# EAGLE design flight comp v3 (EAGLE 9.4.2)
CNAME: FLIGHT COMPUTER; CREVISION: V1; DESIGNER: MICHAEL KIMANI
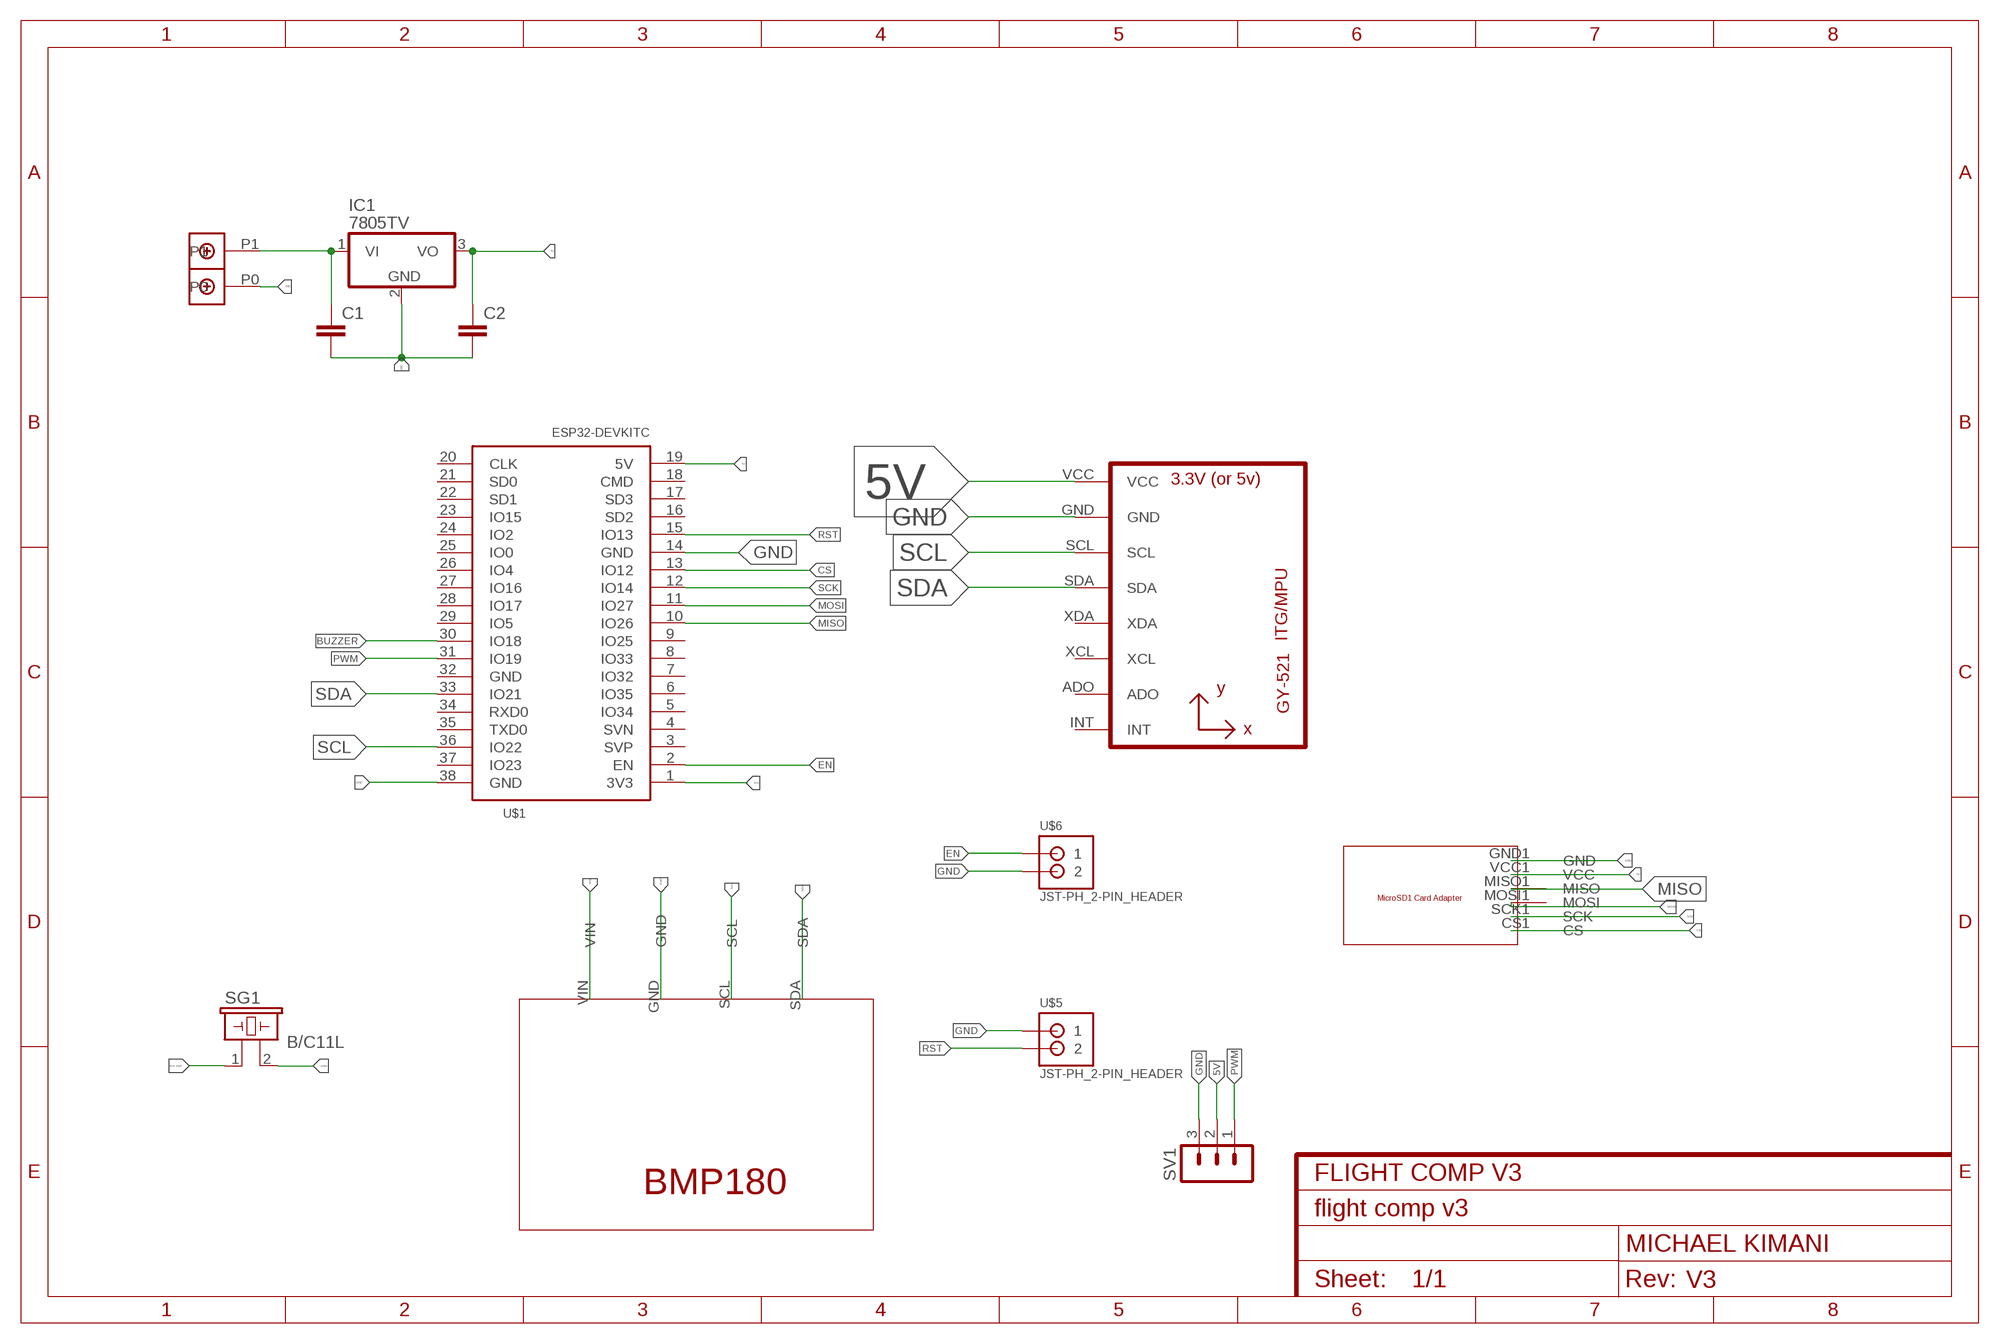
[diagram p0: schematic, sheet 1]
FRAME1 (FRAME-A4L): CNAME: FLIGHT COMP V3; CREVISION: V3; DESIGNER: MICHAEL KIMANI

## Parts
C1  C2,5-3  [C2.5-3]
C2  C2,5-3  [C2.5-3]
IC1  7805TV  [TO220V]
SG1  B/C11L  [B/C11L]
SV1  MA03-1  [MA03-1]
U1  GY-521MPU6050  [GY-521]
U$1  ESP32DEVKITC  [ESP32-DEVKITC]
U$2  MICROSDADAPTER  [MICROSDADAPTER]
U$3  BMP180  [BMP180]
U$4  DBCONN-1X2  [DBCONN-1X2]
U$5  JST-PH_2-PIN_HEADER  [JST_B2B-PH_HEADER]
U$6  JST-PH_2-PIN_HEADER  [JST_B2B-PH_HEADER]

## Nets
3V3: U$1.1(3V3) U$3.VIN
5V: C2.1 IC1.3(VO) SV1.2 U1.VCC U$1.19(5V) U$2.VCC1(VCC)
BUZZER: SG1.1 U$1.30(IO18)
CS: U$1.13(IO12) U$2.CS1(CS)
EN: U$1.2(EN) U$6.P1
GND: C1.2 C2.2 IC1.2(GND) SG1.2 SV1.3 U1.GND U$1.14(GND) U$1.38(GND) U$2.GND1(GND) U$3.GND U$4.P0 U$5.P1 U$6.P2
MISO: U$1.10(IO26) U$2.MISO1(MISO)
MOSI: U$1.11(IO27) U$2.MOSI1(MOSI)
N$1: C1.1 IC1.1(VI) U$4.P1
PWM: SV1.1 U$1.31(IO19)
RST: U$1.15(IO13) U$5.P2
SCK: U$1.12(IO14) U$2.SCK1(SCK)
SCL: U1.SCL U$1.36(IO22) U$3.SCL
SDA: U1.SDA U$1.33(IO21) U$3.SDA
Unconnected: U1.ADO U1.INT U1.XCL U1.XDA U$1.3(SVP) U$1.4(SVN) U$1.5(IO34) U$1.6(IO35) U$1.7(IO32) U$1.8(IO33) U$1.9(IO25) U$1.16(SD2) U$1.17(SD3) U$1.18(CMD) U$1.20(CLK) U$1.21(SD0) U$1.22(SD1) U$1.23(IO15) U$1.24(IO2) U$1.25(IO0) U$1.26(IO4) U$1.27(IO16) U$1.28(IO17) U$1.29(IO5) U$1.32(GND) U$1.34(RXD0) U$1.35(TXD0) U$1.37(IO23)

## Library data of the parts
C1 C2 = capacitor-wima:C: CAPACITOR naming: grid - package width
IC1 = linear:78*: Positive VOLTAGE REGULATOR Source: http://cache.national.com/ds/LM/LM78L05.pdf http://www.fairchildsemi.com/ds/LM/LM7805.pdf
SG1 = buzzer:B/C11L: BUZZER Source: Buerklin; OC_FARNELL: unknown; OC_NEWARK: unknown
SV1 = con-lstb:MA03-1: PIN HEADER; OC_FARNELL: unknown; OC_NEWARK: unknown
U1 = gy-521:GY-521
U$1 = ESP32-DEVKITC:ESP32DEVKITC
U$2 = MicroSD Card Adapter:MICROSDADAPTER
U$3 = bmp1802:BMP180
U$4 = Terminal Block Connector:DBCONN-1X2
U$5 U$6 = srg:JST-PH_2-PIN_HEADER: 2-pin JST PH Shrouded Header, top entry P/N B2B-PH-K-S Mating connector PHR-2 Mating cable assembly: Sparkfun PRT-09914 <http://www.sparkfun.com/products/9914>

## Board
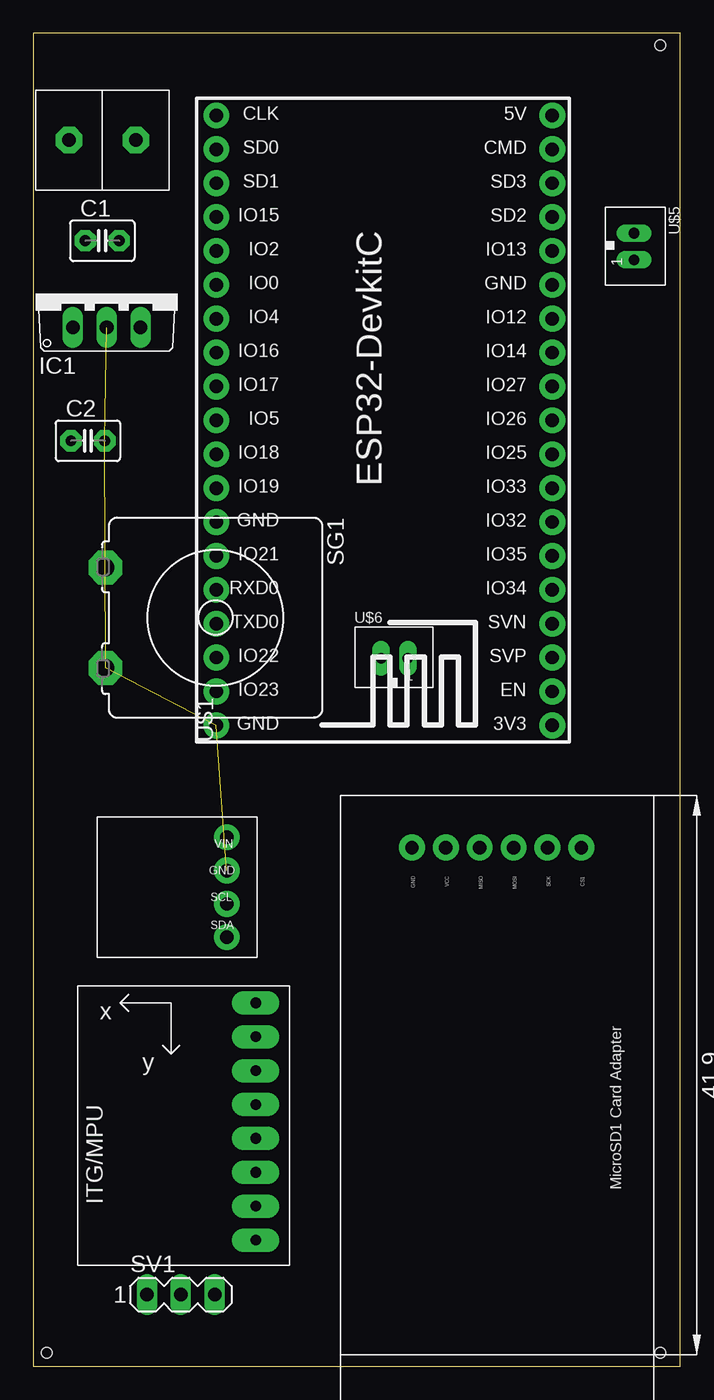
[diagram p1: board, top side]
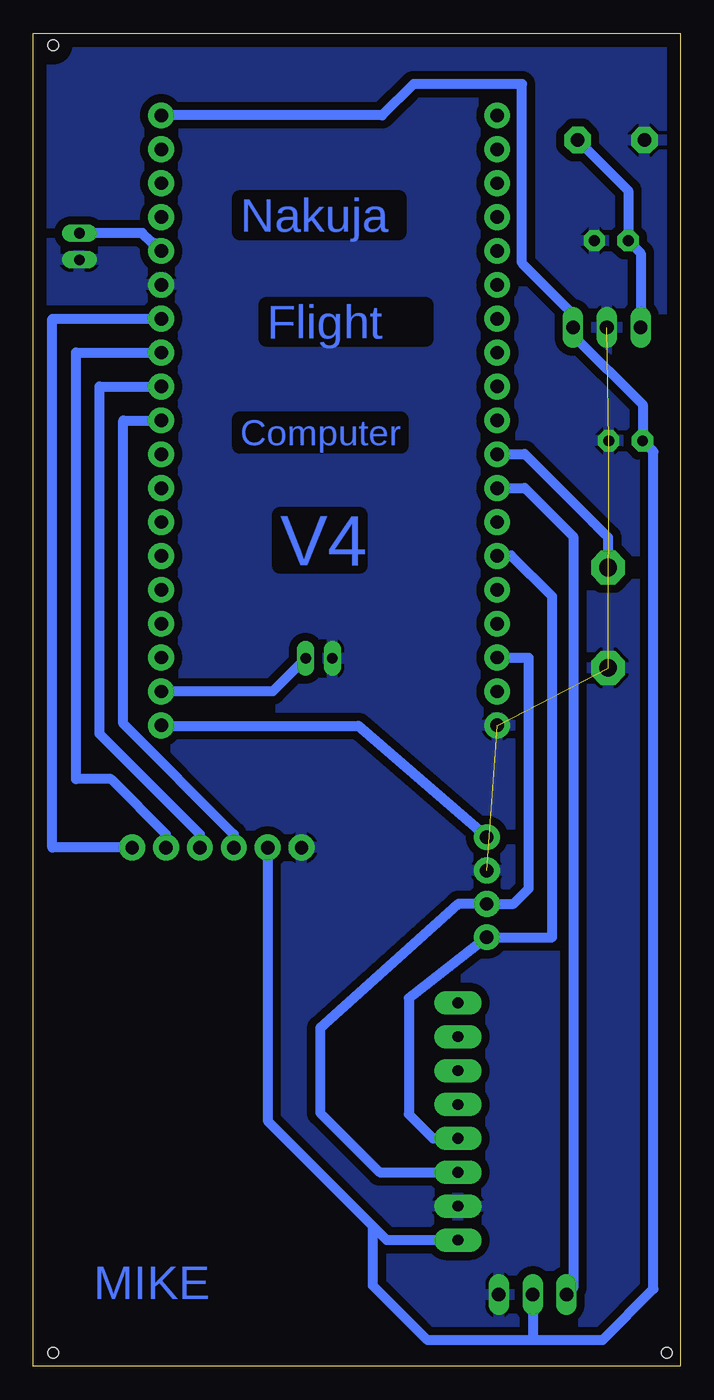
[diagram p2: board, bottom side, seen from below]

Size 48.5 x 99.9 mm. Coordinates in mm from the lower left corner, seen from the top.
Outline: 0,0 48.5,0 48.5,99.9 0,99.9 0,0
Copper layers (1*16): Top 0.035mm / dielectric 1.5mm / Bottom 0.035mm
Design rules "default *": minimum track width 30mil, minimum drill 0.35mm, track to track 20mil, track to pad 20mil, pad to pad 20mil, via to via 6mil, smd to smd 6mil, copper to edge 40mil, drill to drill 6mil, minimum pad ring 10mil, minimum via ring 8mil, stop-mask expansion 4mil, vias tented up to drill 0mil, thermal gap 10mil
Holes 0.8 mm at 47,99 47,1 1,1

### Footprints (pad centres in the part's own frame; a part is rotated, then mirrored left to right if it is on the bottom)
C2.5-3 = drill 0.813 pad 1.6 octagon: 1 -1.27,0; 2 1.27,0
TO220V = drill 1.016 long: 1 -2.54,-2.54; 2 0,-2.54; 3 2.54,-2.54
B/C11L = drill 1.321 pad 2.54 octagon: 1 -3.759,-8.255; 2 3.759,-8.255
MA03-1 = drill 1.016 long: 1 -2.54,0; 2 0,0; 3 2.54,0
GY-521 = drill 0.8 pad 1.778 long: ADO -8.89,-6.35; GND -8.89,6.35; INT -8.89,-8.89; SCL -8.89,3.81; SDA -8.89,1.27; VCC -8.89,8.89; XCL -8.89,-3.81; XDA -8.89,-1.27
ESP32-DEVKITC = drill 1 pad 1.93: 1 -22.87,-11.42; 2 -20.33,-11.42; 3 -17.79,-11.42; 4 -15.25,-11.42; 5 -12.71,-11.42; 6 -10.17,-11.42; 7 -7.63,-11.42; 8 -5.09,-11.42; 9 -2.55,-11.42; 10 -0.01,-11.42; 11 2.53,-11.42; 12 5.07,-11.42; 13 7.61,-11.42; 14 10.15,-11.42; 15 12.69,-11.42; 16 15.23,-11.42; 17 17.77,-11.42; 18 20.31,-11.42; 19 22.85,-11.42; 20 22.85,13.77; 21 20.31,13.77; 22 17.77,13.77; 23 15.23,13.77; 24 12.69,13.77; 25 10.15,13.77; 26 7.61,13.77; 27 5.07,13.77; 28 2.53,13.77; 29 -0.01,13.77; 30 -2.55,13.77; 31 -5.09,13.77; 32 -7.63,13.77; 33 -10.17,13.77; 34 -12.71,13.77; 35 -15.25,13.77; 36 -17.79,13.77; 37 -20.33,13.77; 38 -22.87,13.77
MICROSDADAPTER = drill 1 pad 1.93: CS1 3.9,17.8; GND1 3.9,5.1; MISO1 3.9,10.18; MOSI1 3.9,12.72; SCK1 3.9,15.26; VCC1 3.9,7.64
BMP180 = drill 1 pad 1.93: GND 4,9.73; SCL 6.5,9.73; SDA 9,9.73; VIN 1.5,9.73
DBCONN-1X2 = drill 1 pad 2 octagon: P0 -2.54,0; P1 2.46,0
JST_B2B-PH_HEADER = drill 0.8 long: P1 1.075,0.048; P2 -0.925,0.048

### Placement (x,y rotation side)
C1  5.17,84.36 0 top
C2  4.09,69.36 0 top
IC1  5.5,80.39 0 top
SG1  13.66,56.1 270 top
SV1  11.06,5.36 0 top
U1  7.78,18.34 180 top
U$1  27.49,70.9 90 top
U$2  23.29,42.77 270 top
U$3  4.77,41.15 270 top
U$4  5.22,91.9 0 top
U$5  45,84 270 top
U$6  27,53 0 top

### Tracks (layer width: path | path; a pad name or v marks a point on that pad's centre or on a via)
3V3
  Bottom 0.762: U$3.VIN 24.12,48 38.88,48 U$1.1
5V
  Bottom 0.762: 23.04,10.5 23.04,6.04 18.95,1.95 11,1.95 | U$2.VCC1 30.93,18.39 23.04,10.5 | 11,1.95 5.84,1.95 2,5.78 2,68.54 C2.1 2.82,72.07 8.04,77.29 IC1.3 8.04,78.85 11.87,82.68 11.87,96.1 19.99,96.1 22.34,93.75 U$1.19 | SV1.2 11.06,2.01 11,1.95 | U1.VCC 21.99,9.45 23.04,10.5
BUZZER
  Bottom 0.762: SG1.1 5.41,62.12 11.68,68.39 11.72,68.35 U$1.30
CS
  Bottom 0.762: U$2.CS1 47.07,38.87 47.07,78.51 U$1.13
EN
  Bottom 0.762: U$6.P1 30.55,50.57 U$1.2
GND  (4 unrouted)
  pour Bottom (isolate 0.61): -9,104 61,104 66,99 66,0 58,-8 -9,-8 -21,4 -21,92
MISO
  Bottom 0.762: U$1.10 41.76,70.89 41.76,48.16 33.47,39.87 U$2.MISO1
MOSI
  Bottom 0.762: U$2.MOSI1 36.01,39.87 43.53,47.39 43.53,73.43 U$1.11
N$1
  Bottom 0.762: U$4.P1 3.9,88.12 C1.1 2.96,83.42 IC1.1
PWM
  Bottom 0.762: U$1.31 11.72,65.81 11.68,65.85 8.02,62.19 8.02,5.86 SV1.1
RST
  Bottom 0.762: U$1.15 39.6,84.28 39.68,84.28 40.33,84.92 U$5.P2
SCK
  Bottom 0.762: U$1.12 45.3,75.97 45.3,44 42.68,44 38.55,39.87 U$2.SCK1
SCL
  Bottom 0.762: U1.SCL 22.53,14.53 27,19 27,25.32 16.61,34.65 U$3.SCL 12.5,34.65 11.37,35.78 11.37,53.11 U$1.36
SDA
  Bottom 0.762: U1.SDA 18.53,17.07 20.34,18.87 20.34,27.58 U$3.SDA 9.6,32.15 9.6,57.69 12.68,60.77 12.72,60.73 U$1.33

### Text on the board
Bottom: Nakuja | Flight | Computer | V4 | MIKE